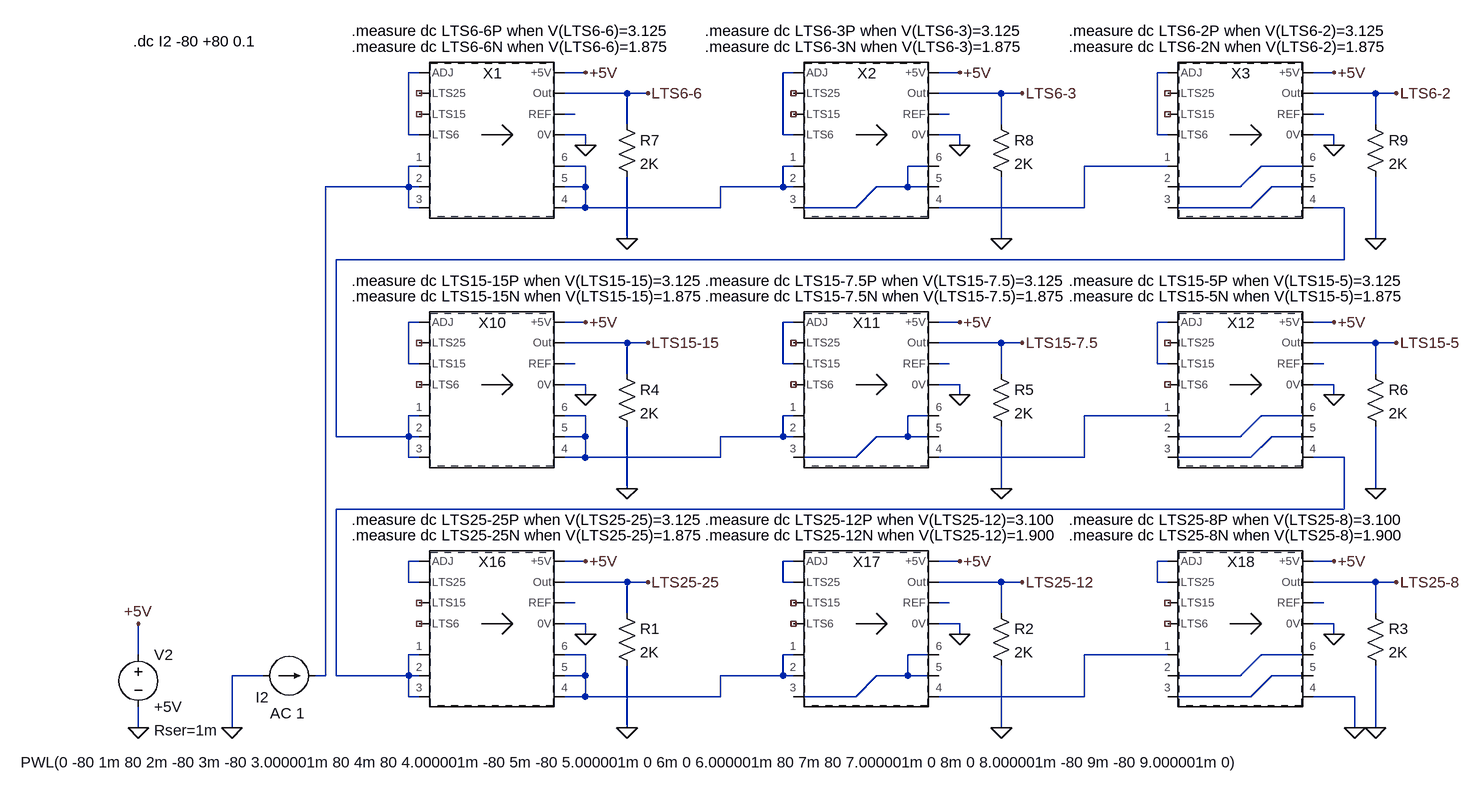
[diagram p0: schematic LTS-XX_hy_Test_DC.asc]
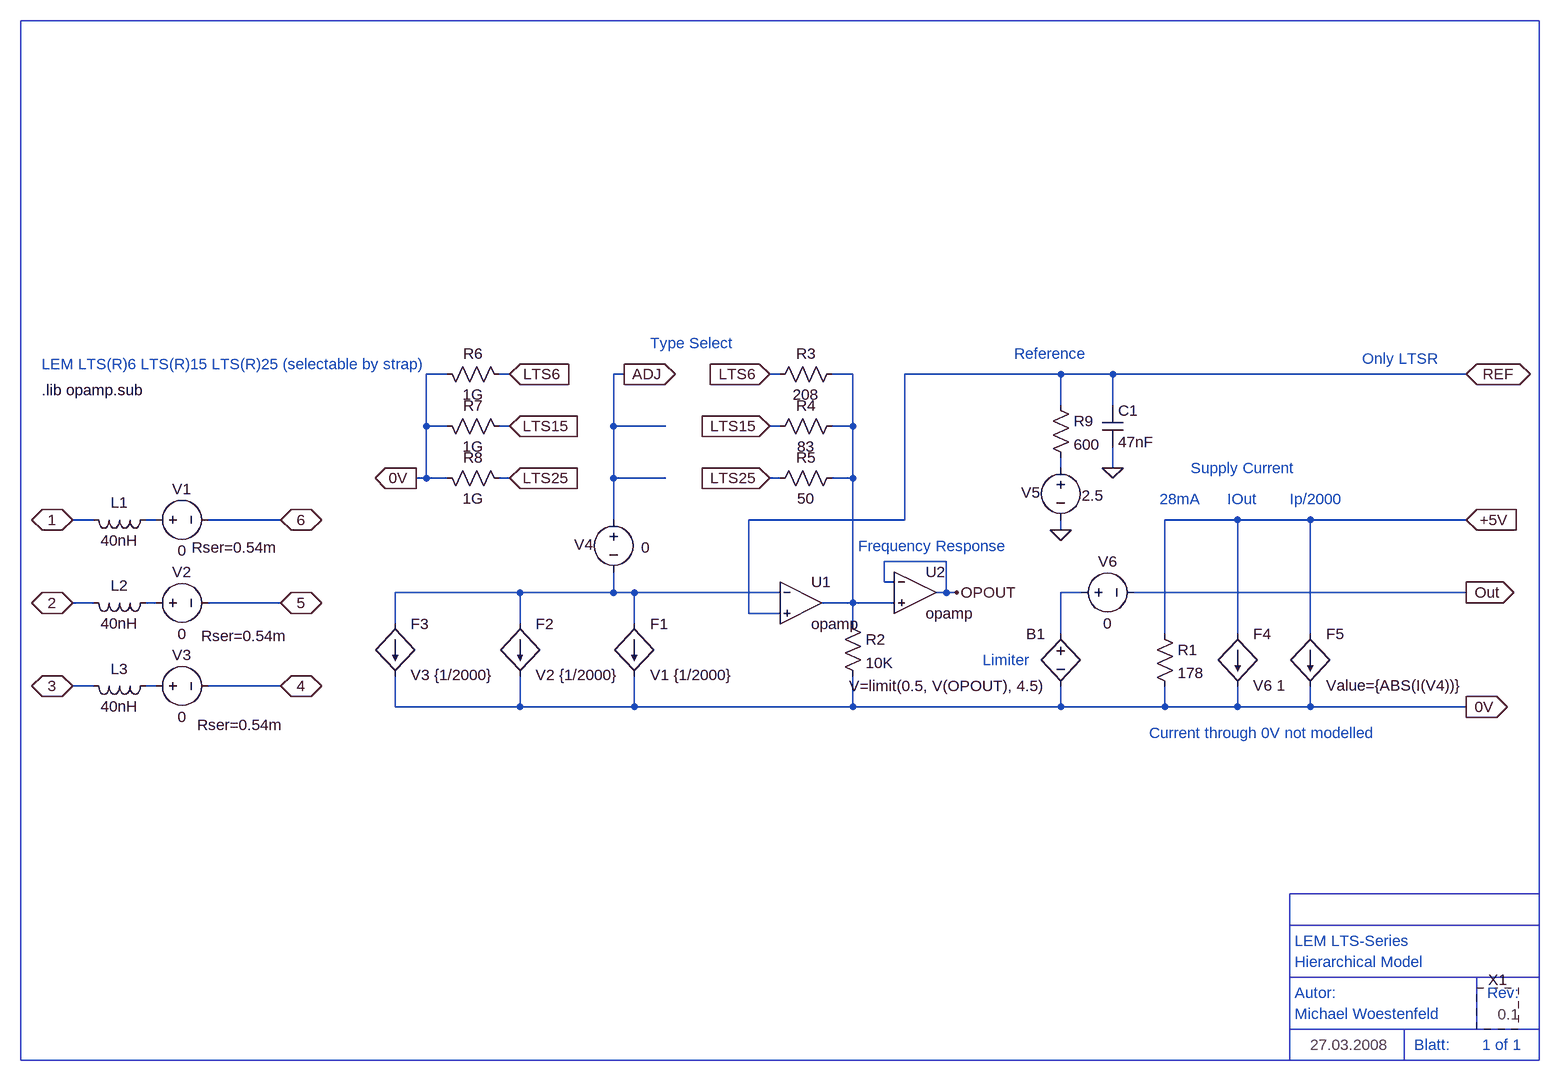
[diagram p1: sub-circuit lts-xx_hy.asc]
LTS-XX_hy_Test_DC.asc, the LTspice schematic file:
Version 4
SHEET 1 2536 1600
WIRE -384 -416 -400 -416
WIRE -128 -416 -160 -416
WIRE 192 -416 176 -416
WIRE 448 -416 416 -416
WIRE 768 -416 752 -416
WIRE 1024 -416 992 -416
WIRE -64 -384 -160 -384
WIRE -32 -384 -64 -384
WIRE 512 -384 416 -384
WIRE 544 -384 512 -384
WIRE 1088 -384 992 -384
WIRE 1120 -384 1088 -384
WIRE -144 -352 -160 -352
WIRE 432 -352 416 -352
WIRE 1008 -352 992 -352
WIRE -64 -336 -64 -384
WIRE 512 -336 512 -384
WIRE 1088 -336 1088 -384
WIRE -400 -320 -400 -416
WIRE -384 -320 -400 -320
WIRE -128 -320 -160 -320
WIRE 176 -320 176 -416
WIRE 192 -320 176 -320
WIRE 448 -320 416 -320
WIRE 752 -320 752 -416
WIRE 768 -320 752 -320
WIRE 1024 -320 992 -320
WIRE -128 -304 -128 -320
WIRE 448 -304 448 -320
WIRE 1024 -304 1024 -320
WIRE -384 -272 -400 -272
WIRE -128 -272 -160 -272
WIRE 192 -272 176 -272
WIRE 416 -272 368 -272
WIRE 768 -272 640 -272
WIRE 992 -272 912 -272
WIRE -400 -240 -400 -272
WIRE -400 -240 -528 -240
WIRE -384 -240 -400 -240
WIRE -128 -240 -128 -272
WIRE -128 -240 -160 -240
WIRE 176 -240 176 -272
WIRE 176 -240 80 -240
WIRE 192 -240 176 -240
WIRE 368 -240 368 -272
WIRE 368 -240 320 -240
WIRE 416 -240 368 -240
WIRE 880 -240 912 -272
WIRE 880 -240 768 -240
WIRE 992 -240 928 -240
WIRE -400 -208 -400 -240
WIRE -384 -208 -400 -208
WIRE -128 -208 -128 -240
WIRE -128 -208 -160 -208
WIRE 80 -208 80 -240
WIRE 80 -208 -128 -208
WIRE 288 -208 320 -240
WIRE 288 -208 192 -208
WIRE 640 -208 640 -272
WIRE 640 -208 416 -208
WIRE 896 -208 928 -240
WIRE 896 -208 768 -208
WIRE 1040 -208 992 -208
WIRE -64 -160 -64 -256
WIRE 512 -160 512 -256
WIRE 1088 -160 1088 -256
WIRE 1040 -128 1040 -208
WIRE 1040 -128 -512 -128
WIRE -384 -32 -400 -32
WIRE -128 -32 -160 -32
WIRE 192 -32 176 -32
WIRE 448 -32 416 -32
WIRE 768 -32 752 -32
WIRE 1024 -32 992 -32
WIRE -64 0 -160 0
WIRE -32 0 -64 0
WIRE 512 0 416 0
WIRE 544 0 512 0
WIRE 1088 0 992 0
WIRE 1120 0 1088 0
WIRE -400 32 -400 -32
WIRE -384 32 -400 32
WIRE -144 32 -160 32
WIRE 176 32 176 -32
WIRE 192 32 176 32
WIRE 432 32 416 32
WIRE 752 32 752 -32
WIRE 768 32 752 32
WIRE 1008 32 992 32
WIRE -64 48 -64 0
WIRE 512 48 512 0
WIRE 1088 48 1088 0
WIRE -128 64 -160 64
WIRE 448 64 416 64
WIRE 1024 64 992 64
WIRE -128 80 -128 64
WIRE 448 80 448 64
WIRE 1024 80 1024 64
WIRE -384 112 -400 112
WIRE -128 112 -160 112
WIRE 192 112 176 112
WIRE 416 112 368 112
WIRE 768 112 640 112
WIRE 992 112 912 112
WIRE -512 144 -512 -128
WIRE -400 144 -400 112
WIRE -400 144 -512 144
WIRE -384 144 -400 144
WIRE -128 144 -128 112
WIRE -128 144 -160 144
WIRE 176 144 176 112
WIRE 176 144 80 144
WIRE 192 144 176 144
WIRE 368 144 368 112
WIRE 368 144 320 144
WIRE 416 144 368 144
WIRE 880 144 912 112
WIRE 880 144 768 144
WIRE 992 144 928 144
WIRE -400 176 -400 144
WIRE -384 176 -400 176
WIRE -128 176 -128 144
WIRE -128 176 -160 176
WIRE 80 176 80 144
WIRE 80 176 -128 176
WIRE 288 176 320 144
WIRE 288 176 192 176
WIRE 640 176 640 112
WIRE 640 176 416 176
WIRE 896 176 928 144
WIRE 896 176 768 176
WIRE 1040 176 992 176
WIRE -64 224 -64 128
WIRE 512 224 512 128
WIRE 1088 224 1088 128
WIRE 1040 256 1040 176
WIRE 1040 256 -512 256
WIRE -384 336 -400 336
WIRE -128 336 -160 336
WIRE 192 336 176 336
WIRE 448 336 416 336
WIRE 768 336 752 336
WIRE 1024 336 992 336
WIRE -400 368 -400 336
WIRE -384 368 -400 368
WIRE -64 368 -160 368
WIRE -32 368 -64 368
WIRE 176 368 176 336
WIRE 192 368 176 368
WIRE 512 368 416 368
WIRE 544 368 512 368
WIRE 752 368 752 336
WIRE 768 368 752 368
WIRE 1088 368 992 368
WIRE 1120 368 1088 368
WIRE -144 400 -160 400
WIRE 432 400 416 400
WIRE 1008 400 992 400
WIRE -64 416 -64 368
WIRE 512 416 512 368
WIRE 1088 416 1088 368
WIRE -128 432 -160 432
WIRE 448 432 416 432
WIRE 1024 432 992 432
WIRE -128 448 -128 432
WIRE 448 448 448 432
WIRE 1024 448 1024 432
WIRE -816 480 -816 432
WIRE -384 480 -400 480
WIRE -128 480 -160 480
WIRE 192 480 176 480
WIRE 416 480 368 480
WIRE 768 480 640 480
WIRE 992 480 912 480
WIRE -624 512 -672 512
WIRE -528 512 -528 -240
WIRE -528 512 -544 512
WIRE -512 512 -512 256
WIRE -400 512 -400 480
WIRE -400 512 -512 512
WIRE -384 512 -400 512
WIRE -128 512 -128 480
WIRE -128 512 -160 512
WIRE 176 512 176 480
WIRE 176 512 80 512
WIRE 192 512 176 512
WIRE 368 512 368 480
WIRE 368 512 320 512
WIRE 416 512 368 512
WIRE 880 512 912 480
WIRE 880 512 768 512
WIRE 992 512 928 512
WIRE -400 544 -400 512
WIRE -384 544 -400 544
WIRE -128 544 -128 512
WIRE -128 544 -160 544
WIRE 80 544 80 512
WIRE 80 544 -128 544
WIRE 288 544 320 512
WIRE 288 544 192 544
WIRE 640 544 640 480
WIRE 640 544 416 544
WIRE 896 544 928 512
WIRE 896 544 768 544
WIRE 1056 544 992 544
WIRE -816 592 -816 560
WIRE -672 592 -672 512
WIRE -64 592 -64 496
WIRE 512 592 512 496
WIRE 1056 592 1056 544
WIRE 1088 592 1088 496
FLAG -672 592 0
FLAG -128 448 0
FLAG -816 592 0
FLAG -816 432 +5V
FLAG -128 336 +5V
FLAG -32 368 LTS25-25
FLAG -64 592 0
FLAG 448 448 0
FLAG 448 336 +5V
FLAG 544 368 LTS25-12
FLAG 512 592 0
FLAG 1024 448 0
FLAG 1024 336 +5V
FLAG 1120 368 LTS25-8
FLAG 1088 592 0
FLAG 1056 592 0
FLAG -128 80 0
FLAG -128 -32 +5V
FLAG -32 0 LTS15-15
FLAG -64 224 0
FLAG 448 80 0
FLAG 448 -32 +5V
FLAG 544 0 LTS15-7.5
FLAG 512 224 0
FLAG 1024 80 0
FLAG 1024 -32 +5V
FLAG 1120 0 LTS15-5
FLAG 1088 224 0
FLAG -128 -304 0
FLAG -128 -416 +5V
FLAG -32 -384 LTS6-6
FLAG -64 -160 0
FLAG 448 -304 0
FLAG 448 -416 +5V
FLAG 544 -384 LTS6-3
FLAG 512 -160 0
FLAG 1024 -304 0
FLAG 1024 -416 +5V
FLAG 1120 -384 LTS6-2
FLAG 1088 -160 0
SYMBOL voltage -816 464 R0
WINDOW 123 0 0 Left 0
WINDOW 39 24 132 Left 0
SYMATTR SpiceLine Rser=1m
SYMATTR InstName V2
SYMATTR Value +5V
SYMBOL res -80 400 R0
SYMATTR InstName R1
SYMATTR Value 2K
SYMBOL res 496 400 R0
SYMATTR InstName R2
SYMATTR Value 2K
SYMBOL res 1072 400 R0
SYMATTR InstName R3
SYMATTR Value 2K
SYMBOL current -624 512 M90
WINDOW 123 58 64 VLeft 0
WINDOW 39 0 0 Left 0
WINDOW 3 133 1535 VLeft 0
WINDOW 0 33 9 VLeft 0
SYMATTR Value2 AC 1
SYMATTR Value PWL(0 -80 1m 80 2m -80 3m -80 3.000001m 80 4m 80 4.000001m -80 5m -80 5.000001m 0 6m 0 6.000001m 80 7m 80 7.000001m 0 8m 0 8.000001m -80 9m -80 9.000001m 0)
SYMATTR InstName I2
SYMBOL res -80 32 R0
SYMATTR InstName R4
SYMATTR Value 2K
SYMBOL res 496 32 R0
SYMATTR InstName R5
SYMATTR Value 2K
SYMBOL res 1072 32 R0
SYMATTR InstName R6
SYMATTR Value 2K
SYMBOL res -80 -352 R0
SYMATTR InstName R7
SYMATTR Value 2K
SYMBOL res 496 -352 R0
SYMATTR InstName R8
SYMATTR Value 2K
SYMBOL res 1072 -352 R0
SYMATTR InstName R9
SYMATTR Value 2K
SYMBOL LTS-XX_hy -272 -304 R0
SYMATTR InstName X1
SYMBOL LTS-XX_hy 304 -304 R0
SYMATTR InstName X2
SYMBOL LTS-XX_hy 880 -304 R0
SYMATTR InstName X3
SYMBOL LTS-XX_hy -272 80 R0
SYMATTR InstName X10
SYMBOL LTS-XX_hy 304 80 R0
SYMATTR InstName X11
SYMBOL LTS-XX_hy 880 80 R0
SYMATTR InstName X12
SYMBOL LTS-XX_hy -272 448 R0
SYMATTR InstName X16
SYMBOL LTS-XX_hy 304 448 R0
SYMATTR InstName X17
SYMBOL LTS-XX_hy 880 448 R0
SYMATTR InstName X18
TEXT -824 -464 Left 0 !.dc I2 -80 +80 0.1
TEXT -488 272 Left 0 !.measure dc LTS25-25P when V(LTS25-25)=3.125
TEXT -488 296 Left 0 !.measure dc LTS25-25N when V(LTS25-25)=1.875
TEXT 56 272 Left 0 !.measure dc LTS25-12P when V(LTS25-12)=3.100
TEXT 56 296 Left 0 !.measure dc LTS25-12N when V(LTS25-12)=1.900
TEXT 616 272 Left 0 !.measure dc LTS25-8P when V(LTS25-8)=3.100
TEXT 616 296 Left 0 !.measure dc LTS25-8N when V(LTS25-8)=1.900
TEXT -488 -96 Left 0 !.measure dc LTS15-15P when V(LTS15-15)=3.125
TEXT -488 -72 Left 0 !.measure dc LTS15-15N when V(LTS15-15)=1.875
TEXT 56 -96 Left 0 !.measure dc LTS15-7.5P when V(LTS15-7.5)=3.125
TEXT 56 -72 Left 0 !.measure dc LTS15-7.5N when V(LTS15-7.5)=1.875
TEXT 616 -96 Left 0 !.measure dc LTS15-5P when V(LTS15-5)=3.125
TEXT 616 -72 Left 0 !.measure dc LTS15-5N when V(LTS15-5)=1.875
TEXT -488 -480 Left 0 !.measure dc LTS6-6P when V(LTS6-6)=3.125
TEXT -488 -456 Left 0 !.measure dc LTS6-6N when V(LTS6-6)=1.875
TEXT 56 -480 Left 0 !.measure dc LTS6-3P when V(LTS6-3)=3.125
TEXT 56 -456 Left 0 !.measure dc LTS6-3N when V(LTS6-3)=1.875
TEXT 616 -480 Left 0 !.measure dc LTS6-2P when V(LTS6-2)=3.125
TEXT 616 -456 Left 0 !.measure dc LTS6-2N when V(LTS6-2)=1.875

lts-xx_hy.asc, the sub-circuit schematic file:
Version 4
SHEET 1 2536 916
WIRE -464 -320 -496 -320
WIRE -368 -320 -384 -320
WIRE -192 -320 -208 -320
WIRE 48 -320 32 -320
WIRE 160 -320 128 -320
WIRE 480 -320 240 -320
WIRE 560 -320 480 -320
WIRE 1104 -320 560 -320
WIRE 480 -272 480 -320
WIRE 560 -272 560 -320
WIRE -496 -240 -496 -320
WIRE -464 -240 -496 -240
WIRE -368 -240 -384 -240
WIRE -208 -240 -208 -320
WIRE -128 -240 -208 -240
WIRE 48 -240 32 -240
WIRE 160 -240 160 -320
WIRE 160 -240 128 -240
WIRE 480 -176 480 -192
WIRE 560 -176 560 -208
WIRE -496 -160 -496 -240
WIRE -496 -160 -512 -160
WIRE -464 -160 -496 -160
WIRE -368 -160 -384 -160
WIRE -208 -160 -208 -240
WIRE -128 -160 -208 -160
WIRE 48 -160 32 -160
WIRE 160 -160 160 -240
WIRE 160 -160 128 -160
WIRE -1008 -96 -1040 -96
WIRE -912 -96 -928 -96
WIRE -720 -96 -832 -96
WIRE -208 -96 -208 -160
WIRE 240 -96 240 -320
WIRE 240 -96 0 -96
WIRE 752 -96 640 -96
WIRE 864 -96 752 -96
WIRE 1104 -96 864 -96
WIRE 480 -80 480 -96
WIRE 304 -32 208 -32
WIRE 208 0 208 -32
WIRE 224 0 208 0
WIRE -352 16 -544 16
WIRE -208 16 -208 -16
WIRE -208 16 -352 16
WIRE -176 16 -208 16
WIRE 48 16 -176 16
WIRE 304 16 304 -32
WIRE 304 16 288 16
WIRE 320 16 304 16
WIRE 512 16 480 16
WIRE 1104 16 592 16
WIRE -1008 32 -1040 32
WIRE -912 32 -928 32
WIRE -720 32 -832 32
WIRE 160 32 160 -160
WIRE 160 32 112 32
WIRE 224 32 160 32
WIRE 0 48 0 -96
WIRE 48 48 0 48
WIRE -544 64 -544 16
WIRE -352 64 -352 16
WIRE -176 64 -176 16
WIRE 160 64 160 32
WIRE 480 80 480 16
WIRE 640 80 640 -96
WIRE 752 80 752 -96
WIRE 864 80 864 -96
WIRE -1008 160 -1040 160
WIRE -912 160 -928 160
WIRE -720 160 -832 160
WIRE -544 192 -544 144
WIRE -352 192 -352 144
WIRE -352 192 -544 192
WIRE -176 192 -176 144
WIRE -176 192 -352 192
WIRE 160 192 160 144
WIRE 160 192 -176 192
WIRE 480 192 480 160
WIRE 480 192 160 192
WIRE 640 192 640 160
WIRE 640 192 480 192
WIRE 752 192 752 160
WIRE 752 192 640 192
WIRE 864 192 864 160
WIRE 864 192 752 192
WIRE 1104 192 864 192
FLAG -1040 -96 1
IOPIN -1040 -96 BiDir
FLAG -1040 32 2
IOPIN -1040 32 BiDir
FLAG -1040 160 3
IOPIN -1040 160 BiDir
FLAG -720 -96 6
IOPIN -720 -96 BiDir
FLAG -720 32 5
IOPIN -720 32 BiDir
FLAG -720 160 4
IOPIN -720 160 BiDir
FLAG 1104 -96 +5V
IOPIN 1104 -96 In
FLAG 1104 16 Out
IOPIN 1104 16 Out
FLAG 1104 192 0V
IOPIN 1104 192 Out
FLAG 320 16 OPOUT
FLAG -192 -320 ADJ
IOPIN -192 -320 Out
FLAG 32 -320 LTS6
IOPIN 32 -320 In
FLAG 32 -240 LTS15
IOPIN 32 -240 In
FLAG 32 -160 LTS25
IOPIN 32 -160 In
FLAG -368 -320 LTS6
IOPIN -368 -320 In
FLAG -368 -240 LTS15
IOPIN -368 -240 In
FLAG -368 -160 LTS25
IOPIN -368 -160 In
FLAG -512 -160 0V
IOPIN -512 -160 Out
FLAG 480 -80 0
FLAG 1104 -320 REF
IOPIN 1104 -320 BiDir
FLAG 560 -176 0
SYMBOL voltage -928 -96 R270
WINDOW 0 32 56 VTop 0
WINDOW 3 -32 56 VBottom 0
WINDOW 123 0 0 Left 0
WINDOW 39 -58 137 VTop 0
SYMATTR InstName V1
SYMATTR Value 0
SYMATTR SpiceLine Rser=0.54m
SYMBOL voltage -928 32 R270
WINDOW 0 32 56 VTop 0
WINDOW 3 -32 56 VBottom 0
WINDOW 123 0 0 Left 0
WINDOW 39 -35 152 VBottom 0
SYMATTR InstName V2
SYMATTR Value 0
SYMATTR SpiceLine Rser=0.54m
SYMBOL voltage -928 160 R270
WINDOW 0 32 56 VTop 0
WINDOW 3 -32 56 VBottom 0
WINDOW 123 0 0 Left 0
WINDOW 39 -44 146 VBottom 0
SYMATTR InstName V3
SYMATTR Value 0
SYMATTR SpiceLine Rser=0.54m
SYMBOL res 144 -336 R90
WINDOW 0 0 56 VBottom 0
WINDOW 3 32 56 VTop 0
SYMATTR InstName R3
SYMATTR Value 208
SYMBOL voltage 480 -192 M0
WINDOW 0 46 70 Bottom 0
WINDOW 3 -49 43 Top 0
WINDOW 123 0 0 Left 0
WINDOW 39 -58 137 VTop 0
SYMATTR InstName V5
SYMATTR Value 2.5
SYMBOL voltage 496 16 R270
WINDOW 0 32 56 VTop 0
WINDOW 3 -32 56 VBottom 0
WINDOW 123 0 0 Left 0
WINDOW 39 -58 137 VTop 0
SYMATTR InstName V6
SYMATTR Value 0
SYMBOL f -176 64 R0
WINDOW 3 24 79 Left 0
SYMATTR Value V1 {1/2000}
SYMATTR InstName F1
SYMBOL f -352 64 R0
WINDOW 3 24 79 Left 0
SYMATTR Value V2 {1/2000}
SYMATTR InstName F2
SYMBOL f -544 64 R0
WINDOW 3 24 79 Left 0
SYMATTR Value V3 {1/2000}
SYMATTR InstName F3
SYMBOL res 624 64 R0
SYMATTR InstName R1
SYMATTR Value 178
SYMBOL f 752 80 R0
WINDOW 3 24 79 Left 0
SYMATTR Value V6 1
SYMATTR InstName F4
SYMBOL Opamps\\opamp 256 -48 R0
SYMATTR InstName U2
SYMATTR SpiceLine2 GBW=1.5Meg
SYMBOL res 144 48 R0
SYMATTR InstName R2
SYMATTR Value 10K
SYMBOL bv 480 64 M0
SYMATTR InstName B1
SYMATTR Value V=limit(0.5, V(OPOUT), 4.5)
SYMBOL res 144 -256 R90
WINDOW 0 0 56 VBottom 0
WINDOW 3 32 56 VTop 0
SYMATTR InstName R4
SYMATTR Value 83
SYMBOL res 144 -176 R90
WINDOW 0 0 56 VBottom 0
WINDOW 3 32 56 VTop 0
SYMATTR InstName R5
SYMATTR Value 50
SYMBOL res -480 -336 M90
WINDOW 0 0 56 VBottom 0
WINDOW 3 32 56 VTop 0
SYMATTR InstName R6
SYMATTR Value 1G
SYMBOL res -480 -256 M90
WINDOW 0 0 56 VBottom 0
WINDOW 3 32 56 VTop 0
SYMATTR InstName R7
SYMATTR Value 1G
SYMBOL res -480 -176 M90
WINDOW 0 0 56 VBottom 0
WINDOW 3 32 56 VTop 0
SYMATTR InstName R8
SYMATTR Value 1G
SYMBOL voltage -208 -112 M0
WINDOW 0 46 70 Bottom 0
WINDOW 3 -49 43 Top 0
WINDOW 123 0 0 Left 0
WINDOW 39 -58 137 VTop 0
SYMATTR InstName V4
SYMATTR Value 0
SYMBOL f 864 80 R0
WINDOW 3 24 79 Left 0
SYMATTR Value Value={ABS(I(V4))}
SYMATTR InstName F5
SYMBOL res 464 -288 R0
SYMATTR InstName R9
SYMATTR Value 600
SYMBOL cap 544 -272 R0
SYMATTR InstName C1
SYMATTR Value 47nF
SYMBOL Opamps\\opamp 80 -32 R0
SYMATTR InstName U1
SYMBOL ind -912 -112 R90
WINDOW 0 5 56 VBottom 0
WINDOW 3 32 56 VTop 0
SYMATTR InstName L1
SYMATTR Value 40nH
SYMBOL ind -912 16 R90
WINDOW 0 5 56 VBottom 0
WINDOW 3 32 56 VTop 0
SYMATTR InstName L2
SYMATTR Value 40nH
SYMBOL ind -912 144 R90
WINDOW 0 5 56 VBottom 0
WINDOW 3 32 56 VTop 0
SYMATTR InstName L3
SYMATTR Value 40nH
SYMBOL Version 1152 656 R0
SYMATTR InstName X1
TEXT -1088 -296 Left 0 !.lib opamp.sub
TEXT -1088 -336 Left 0 ;LEM LTS(R)6 LTS(R)15 LTS(R)25 (selectable by strap)
TEXT 632 -128 Left 0 ;28mA
TEXT 736 -128 Left 0 ;IOut
TEXT 832 -128 Left 0 ;Ip/2000
TEXT 680 -176 Left 0 ;Supply Current
TEXT 616 232 Left 0 ;Current through 0V not modelled
TEXT -152 -368 Left 0 ;Type Select
TEXT 944 -344 Left 0 ;Only LTSR
TEXT 408 -352 Left 0 ;Reference
TEXT 168 -56 Left 0 ;Frequency Response
TEXT 360 120 Left 0 ;Limiter
TEXT 1024 712 Left 0 ;Blatt:
TEXT 1136 632 Left 0 ;Rev:
TEXT 840 632 Left 0 ;Autor:
TEXT 1128 712 Left 0 ;1 of 1
TEXT 840 664 Left 0 ;Michael Woestenfeld
TEXT 840 552 Left 0 ;LEM LTS-Series
TEXT 840 584 Left 0 ;Hierarchical Model
LINE Normal 832 480 1216 480
LINE Normal 832 736 832 480
LINE Normal 832 528 1216 528
RECTANGLE Normal -1120 -864 1216 736
RECTANGLE Normal 1216 736 1008 688
RECTANGLE Normal 1008 736 832 688
RECTANGLE Normal 1216 688 1120 608
RECTANGLE Normal 1120 688 832 608

The netlist it stands for:
* LTS-XX_hy_Test_DC.asc
V2 +5V 0 +5V Rser=1m
R1 LTS25-25 0 2K
R2 LTS25-12 0 2K
R3 LTS25-8 0 2K
I2 0 N007 PWL(0 -80 1m 80 2m -80 3m -80 3.000001m 80 4m 80 4.000001m -80 5m -80 5.000001m 0 6m 0 6.000001m 80 7m 80 7.000001m 0 8m 0 8.000001m -80 9m -80 9.000001m 0) AC 1
R4 LTS15-15 0 2K
R5 LTS15-7.5 0 2K
R6 LTS15-5 0 2K
R7 LTS6-6 0 2K
R8 LTS6-3 0 2K
R9 LTS6-2 0 2K
XX1 +5V 0 LTS6-6 N007 N007 N007 N008 N008 N008 N001 NC_01 NC_02 N001 N004 lts-xx_hy
XX2 +5V 0 LTS6-3 N008 N008 N009 N010 N009 N009 N002 NC_03 NC_04 N002 N005 lts-xx_hy
XX3 +5V 0 LTS6-2 N010 N011 N012 N013 N012 N011 N003 NC_05 NC_06 N003 N006 lts-xx_hy
XX10 +5V 0 LTS15-15 N013 N013 N013 N020 N020 N020 N014 NC_07 N014 NC_08 N017 lts-xx_hy
XX11 +5V 0 LTS15-7.5 N020 N020 N021 N022 N021 N021 N015 NC_09 N015 NC_10 N018 lts-xx_hy
XX12 +5V 0 LTS15-5 N022 N023 N024 N025 N024 N023 N016 NC_11 N016 NC_12 N019 lts-xx_hy
XX16 +5V 0 LTS25-25 N025 N025 N025 N032 N032 N032 N026 N026 NC_13 NC_14 N029 lts-xx_hy
XX17 +5V 0 LTS25-12 N032 N032 N033 N034 N033 N033 N027 N027 NC_15 NC_16 N030 lts-xx_hy
XX18 +5V 0 LTS25-8 N034 N035 N036 0 N036 N035 N028 N028 NC_17 NC_18 N031 lts-xx_hy

* block symbol definitions
.subckt lts-xx_hy +5V 0V Out 1 2 3 4 5 6 ADJ LTS25 LTS15 LTS6 REF
V1 N003 6 0 Rser=0.54m
V2 N006 5 0 Rser=0.54m
V3 N007 4 0 Rser=0.54m
R3 N001 LTS6 208
V5 N002 0 2.5
V6 N005 Out 0
F1 N004 0V V1 {1/2000}
F2 N004 0V V2 {1/2000}
F3 N004 0V V3 {1/2000}
R1 +5V 0V 178
F4 +5V 0V V6 1
XU2 OPOUT N001 OPOUT opamp Aol=100K GBW=1.5Meg  ; pins invin noninvin out
R2 N001 0V 10K
B1 N005 0V V=limit(0.5, V(OPOUT), 4.5)
R4 N001 LTS15 83
R5 N001 LTS25 50
R6 0V LTS6 1G
R7 0V LTS15 1G
R8 0V LTS25 1G
V4 ADJ N004 0
F5 +5V 0V Value={ABS(I(V4))}
R9 REF N002 600
C1 REF 0 47nF
XU1 N004 REF N001 opamp Aol=100K GBW=10Meg  ; pins invin noninvin out
L1 N003 1 40nH
L2 N006 2 40nH
L3 N007 3 40nH
XX1 Version
.lib opamp.sub
* LEM LTS(R)6 LTS(R)15 LTS(R)25 (selectable by strap)
* 28mA
* IOut
* Ip/2000
* Supply Current
* Current through 0V not modelled
* Type Select
* Only LTSR
* Reference
* Frequency Response
* Limiter
* Blatt:
* Rev:
* Autor:
* 1 of 1
* Michael Woestenfeld
* LEM LTS-Series
* Hierarchical Model
.ends lts-xx_hy

.dc I2 -80 +80 0.1
.measure dc LTS25-25P when V(LTS25-25)=3.125
.measure dc LTS25-25N when V(LTS25-25)=1.875
.measure dc LTS25-12P when V(LTS25-12)=3.100
.measure dc LTS25-12N when V(LTS25-12)=1.900
.measure dc LTS25-8P when V(LTS25-8)=3.100
.measure dc LTS25-8N when V(LTS25-8)=1.900
.measure dc LTS15-15P when V(LTS15-15)=3.125
.measure dc LTS15-15N when V(LTS15-15)=1.875
.measure dc LTS15-7.5P when V(LTS15-7.5)=3.125
.measure dc LTS15-7.5N when V(LTS15-7.5)=1.875
.measure dc LTS15-5P when V(LTS15-5)=3.125
.measure dc LTS15-5N when V(LTS15-5)=1.875
.measure dc LTS6-6P when V(LTS6-6)=3.125
.measure dc LTS6-6N when V(LTS6-6)=1.875
.measure dc LTS6-3P when V(LTS6-3)=3.125
.measure dc LTS6-3N when V(LTS6-3)=1.875
.measure dc LTS6-2P when V(LTS6-2)=3.125
.measure dc LTS6-2N when V(LTS6-2)=1.875
.backanno
.end